# Altium schematic sheet POWER_SUPPLY.SchDoc
size A4; SheetNumber: 2; SheetTotal: 3
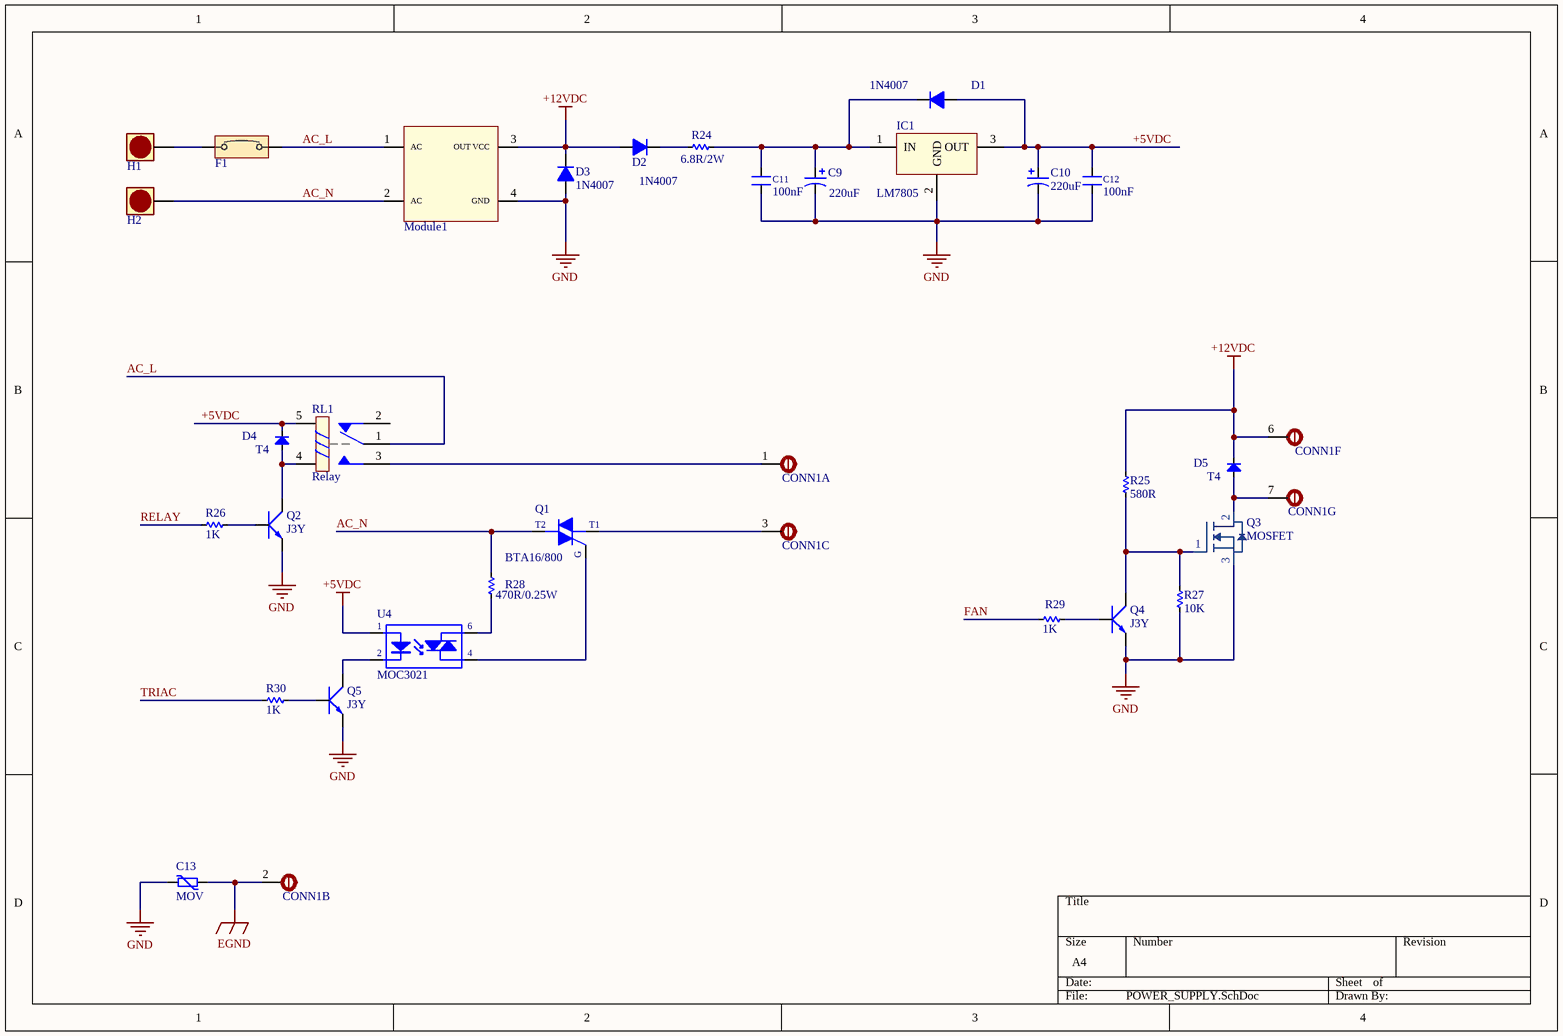
[diagram p0: POWER_SUPPLY.SchDoc]

## Parts
C9  220uF  [C8MM]
C10  220uF  [C8MM]
C11  100nF  [SM-Cap-1206]
C12  100nF  [SM-Cap-1206]
C13  MOV  [14D271K]
CONN1  GX-16 CONNECTOR  [GX-16]  (value not drawn)  (parts A,B,C,F,G of 8)
D1  1N4007  [DO-213AA]
D2  1N4007  [DO-213AA]
D3  1N4007  [DO-213AA]
D4  T4  [SOD123]
D5  T4  [SOD123]
F1  FUSE  [FUSE 5X20MM]  (value not drawn)
H1  JP1P  [PW-JP]  (value not drawn)
H2  JP1P  [PW-JP]  (value not drawn)
IC1  LM7805  [QTO-220H3]
Module1  AC DC Powersupply  [VNPT_ADAPTER]  (value not drawn)
Q1  BTA16/800  [TO220H2]
Q2  J3Y  [SOT23B]
Q3  MOSFET  [TO-252]
Q4  J3Y  [SOT23B]
Q5  J3Y  [SOT23B]
R24  6.8R/2W  [R2WD]
R25  580R  [RES-SMD-0805]
R26  1K  [RES-SMD-0805]
R27  10K  [RES-SMD-0603]
R28  470R/0.25W  [RES-1/4W]
R29  1K  [RES-SMD-0805]
R30  1K  [RES-SMD-0805]
RL1  Relay  [RL-05VDC-10A]
U4  MOC3021  [DIP6/W0.3 - MOC3021]

## Nets
+5VDC: C10.1 C12.1 D1.1 D4.K IC1.3(OUT) RL1.5 U4.1(A)
+12VDC: CONN1.6 D2.1 D3.2 D5.K Module1.3(OUT_VCC) R25.1
EGND: C13.1 CONN1.2
GND: C9.2 C10.2 C11.2 C12.2 C13.2 D3.1 IC1.2(GND) Module1.4(GND) Q2.1(E) Q3.3 Q4.1(E) Q5.1(E) R27.2
AC_L: F1.2 Module1.1(AC) RL1.1
AC_N: H2.1 Module1.2(AC) Q1.2(M2) R28.1
FAN: R29.2
RELAY: R26.2
TRIAC: R30.2
NetC9_1: C9.1 C11.1 D1.2 IC1.1(IN) R24.1
NetCONN1_1: CONN1.1 RL1.3
NetCONN1_3: CONN1.3 Q1.1(M1)
NetCONN1_7: CONN1.7 D5.A Q3.2
NetD2_2: D2.2 R24.2
NetD4_A: D4.A Q2.3(C) RL1.4
NetF1_1: F1.1 H1.1
NetQ1_3: Q1.3(G) U4.4(E)
NetQ2_2: Q2.2(B) R26.1
NetQ3_1: Q3.1 Q4.3(C) R25.2 R27.1
NetQ4_2: Q4.2(B) R29.1
NetQ5_2: Q5.2(B) R30.1
NetQ5_3: Q5.3(C) U4.2(K)
NetR28_2: R28.2 U4.6(C)

Not connected (* = marked no-connect by the designer): RL1 2

## Notes on the sheet
- (in symbol BTA12-600_TRIAC) T2; T1

## Library data of the parts
C9 C10 = CAP-Radial: Published: 8-Jun-2000; LatestRevisionDate: 17-Jul-2002; LatestRevisionNote: Re-released for DXP Platform.; PackageReference: POLAR0.8; Publisher: Altium Limited; value: ?
C11 C12 = CAP SMD: Value: 0,1uF/300V; Designed by: VanDungEvn
D1-D3 = Diode  1N4007: Diode 1A; pin to pad: 1>A 2>K; Value: 1N4007
D4 D5 = Diode-1N4007 -A4: Default Diode; Code - JEDEC: DO-214-AB; Value: 1N5007; Published: 8-Jun-2000; Revision: July-2002: Re-released for DXP Platform.; Publisher: Altium Limited
IC1 = LM78xx: On ap +, from + 5 to + 24VDC; Value: LM7805
Q1 = BTA12-600_TRIAC: Silicon Bidirectional Triode Thyristor; Note: Pin 2 is electrically connected to Pin 4 (TAB); Published: 29-Sep-2000; LatestRevisionDate: 17-Jul-2002; LatestRevisionNote: Re-released for DXP Platform.; DatasheetDocument: 1999; PackageReference: 369-03; Publisher: Altium Limited; Code_JEDEC: TO-251-AA; ComponentLink1Description: Manufacturer Link; ComponentLink1URL: http://www.motorola.com/
Q2 Q4 Q5 = 2N222: NPN 600mW, ECB; pin to pad: 1>2 2>1; Value: C1815
Q3 = MOSFET-N: MOSFET N chane
R24 R28 = Res_DIP: Res; Manufacturer: Generic Components; Class: Passive; SubClass: R; Published: 08/06/2000; Publisher: Altium Hobart Technology Centre
R25-R27 R29 R30 = Res-SMD: Resistor; Manufacturer: Generic Components; Class: Passive; Published: 08/06/2000; Publisher: Altium Hobart Technology Centre
RL1 = Relay 5VDC: Relay SPDT 5 Pin; Value: Relay SPDT, 10A, 12V
U4 = MOC3021: Single Opto; Value: MOC3021